# Altium schematic sheet Controller.SchDoc
size 254 x 228 mm; SheetNumber: 12; SheetTotal: 12
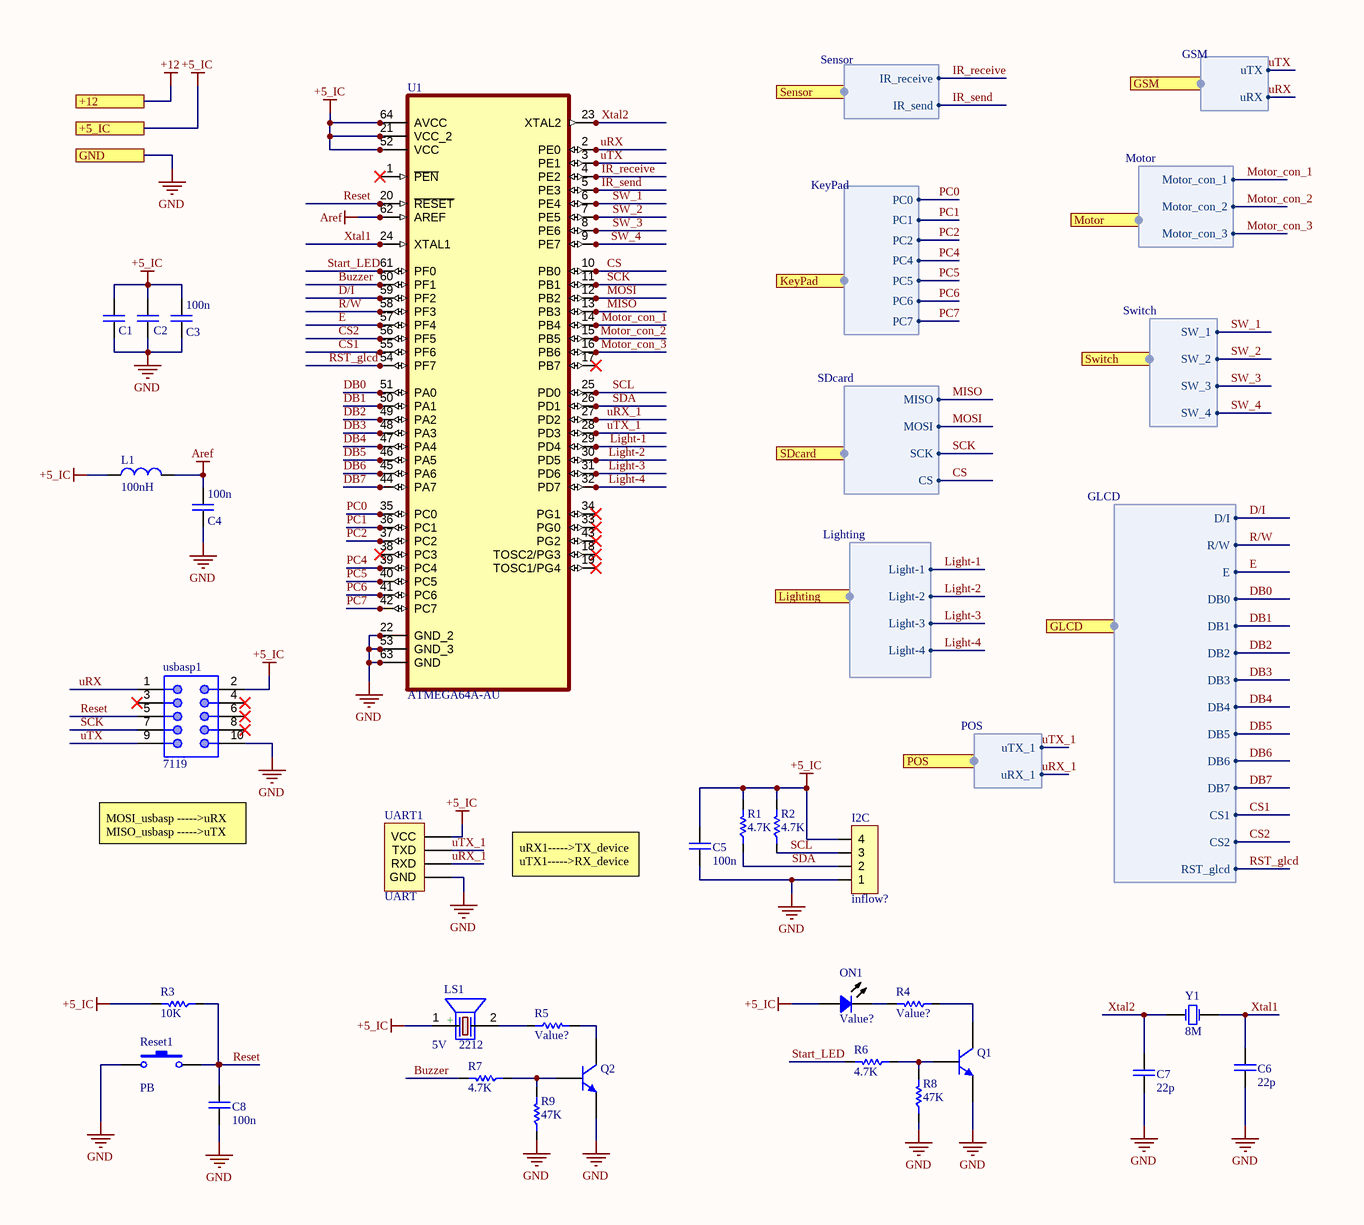
[diagram p0: Controller.SchDoc]

## Parts
C1  (no value)  [CAP 1206/3216]
C2  (no value)  [CAP 1206/3216]
C3  100n  [CAP 1206/3216]
C4  100n  [CAP 1206/3216]
C5  100n  [CAP 1206/3216]
C6  22p  [CAP 1206/3216]
C7  22p  [CAP 1206/3216]
C8  100n  [CAP 1206/3216]
I2C  Inflow: inflow?  [MOLEX KK 0022272041]  (hidden comment: 4'Pin)
L1  100nH  [IND1206]
LS1  Inflow: 2212  [BZ_SJ]  (hidden comment: 5V)
ON1  Value?  [LED 1206/3216 GREEN]
Q1  NPN  [SOT23_N]  (value not drawn)
Q2  NPN  [SOT23_N]  (value not drawn)
R1  value 4.7K  [RES 1206 (3216X08L)]  (hidden comment: Value?)
R2  value 4.7K  [RES 1206 (3216X08L)]  (hidden comment: Value?)
R3  value 10K  [RES 1206 (3216X08L)]  (hidden comment: 4.7K)
R4  value Value?  [RES 1206 (3216X08L)]  (hidden comment: 47K)
R5  Value?  [RES 1206 (3216X08L)]
R6  value 4.7K  [RES 1206 (3216X08L)]  (hidden comment: Value?)
R7  4.7K  [RES 1206 (3216X08L)]
R8  value 47K  [RES 1206 (3216X08L)]  (hidden comment: 4.7K)
R9  47K  [RES 1206 (3216X08L)]
Reset1  PB  [SW_PB_SMD_2PIN_SPST_6X3X2]
U1  ATMEGA64A-AU  [QFP80P1600X1600X120-64N]
UART1  UART  [MOLEX KK 0022272041]
usbasp1  Inflow: 7119  [BOX-HDR-5X2-2.54mm-S]  (hidden comment: 5x2)
Y1  8M  [XTAL Small]

## Ports
+5_IC, +12, GLCD (harness GLCD), GND, GSM (harness GSM), KeyPad (harness KeyPad), Lighting (harness Lighting), Motor (harness Motor), POS (harness POS), SDcard (harness SDcard), Sensor (harness Sensor), Switch (harness Switch)

## Harnesses
GSM: uTX, uRX
Switch: SW_1, SW_2, SW_3, SW_4
GLCD: D/I, R/W, E, DB0, DB1, DB2, DB3, DB4, DB5, DB6, DB7, CS1, CS2, RST_glcd
Sensor: IR_receive, IR_send
KeyPad: PC0, PC1, PC2, PC4, PC5, PC6, PC7
SDcard: MISO, MOSI, SCK, CS
Lighting: Light-1, Light-2, Light-3, Light-4
Motor: Motor_con_1, Motor_con_2, Motor_con_3
POS: uTX_1, uRX_1

## Nets
+5_IC: C1.1 C2.1 C3.1 C5.1 I2C.4 L1.1 LS1.1(+) ON1.1 R1.2 R2.2 R3.2 U1.21(VCC_2) U1.52(VCC) U1.64(AVCC) UART1.1(VCC) usbasp1.2 ; port +5_IC
+12: port +12
Aref: C4.1 L1.2 U1.62(AREF)
GND: C1.2 C2.2 C3.2 C4.2 C5.2 C6.2 C7.2 C8.2 I2C.1 Q1.2(E) Q2.2(E) R8.1 R9.1 Reset1.1 U1.22(GND_2) U1.53(GND_3) U1.63(GND) UART1.4(GND) usbasp1.10 ; port GND
Buzzer: R7.2 U1.60(PF1)
CS: U1.10(PB0) ; port SDcard.CS
CS1: U1.55(PF6) ; port GLCD.CS1
CS2: U1.56(PF5) ; port GLCD.CS2
D/I: U1.59(PF2) ; port GLCD.D/I
DB0: U1.51(PA0) ; port GLCD.DB0
DB1: U1.50(PA1) ; port GLCD.DB1
DB2: U1.49(PA2) ; port GLCD.DB2
DB3: U1.48(PA3) ; port GLCD.DB3
DB4: U1.47(PA4) ; port GLCD.DB4
DB5: U1.46(PA5) ; port GLCD.DB5
DB6: U1.45(PA6) ; port GLCD.DB6
DB7: U1.44(PA7) ; port GLCD.DB7
E: U1.57(PF4) ; port GLCD.E
IR_receive: U1.4(PE2) ; port Sensor.IR_receive
IR_send: U1.5(PE3) ; port Sensor.IR_send
Light-1: U1.29(PD4) ; port Lighting.Light-1
Light-2: U1.30(PD5) ; port Lighting.Light-2
Light-3: U1.31(PD6) ; port Lighting.Light-3
Light-4: U1.32(PD7) ; port Lighting.Light-4
MISO: U1.13(PB3) ; port SDcard.MISO
MOSI: U1.12(PB2) ; port SDcard.MOSI
Motor_con_1: U1.14(PB4) ; port Motor.Motor_con_1
Motor_con_2: U1.15(PB5) ; port Motor.Motor_con_2
Motor_con_3: U1.16(PB6) ; port Motor.Motor_con_3
PC0: U1.35(PC0) ; port KeyPad.PC0
PC1: U1.36(PC1) ; port KeyPad.PC1
PC2: U1.37(PC2) ; port KeyPad.PC2
PC4: U1.39(PC4) ; port KeyPad.PC4
PC5: U1.40(PC5) ; port KeyPad.PC5
PC6: U1.41(PC6) ; port KeyPad.PC6
PC7: U1.42(PC7) ; port KeyPad.PC7
R/W: U1.58(PF3) ; port GLCD.R/W
Reset: C8.1 R3.1 Reset1.2 U1.20(~{RESET}) usbasp1.5
RST_glcd: U1.54(PF7) ; port GLCD.RST_glcd
SCK: U1.11(PB1) usbasp1.7 ; port SDcard.SCK
SCL: I2C.3 R2.1 U1.25(PD0)
SDA: I2C.2 R1.1 U1.26(PD1)
Start_LED: R6.2 U1.61(PF0)
SW_1: U1.6(PE4) ; port Switch.SW_1
SW_2: U1.7(PE5) ; port Switch.SW_2
SW_3: U1.8(PE6) ; port Switch.SW_3
SW_4: U1.9(PE7) ; port Switch.SW_4
uRX: U1.2(PE0) usbasp1.1 ; port GSM.uRX
uRX_1: U1.27(PD2) UART1.3(RXD) ; port POS.uRX_1
uTX: U1.3(PE1) usbasp1.9 ; port GSM.uTX
uTX_1: U1.28(PD3) UART1.2(TXD) ; port POS.uTX_1
Xtal1: C6.1 U1.24(XTAL1) Y1.2(OSC2)
Xtal2: C7.1 U1.23(XTAL2) Y1.1(OSC1)
NetLS1_2: LS1.2(-) R5.1
NetON1_2: ON1.2 R4.2
NetQ1_1: Q1.1(B) R6.1 R8.2
NetQ1_3: Q1.3(C) R4.1
NetQ2_1: Q2.1(B) R7.1 R9.2
NetQ2_3: Q2.3(C) R5.2

Not connected (* = marked no-connect by the designer): U1 1(~{PEN})* 17(PB7)* 18(TOSC2/PG3)* 19(TOSC1/PG4)* 33(PG0)* 34(PG1)* 38(PC3)* 43(PG2)*; usbasp1 3* 4* 6* 8*

## Notes on the sheet
- MOSI_usbasp ----->uRX MISO_usbasp ----->uTX
- uRX1----->TX_device
  uTX1----->RX_device
- DWG. NO.
- REV.
- SHT.
- THIS DOCUMENT AND THE DATA DISCLOSED HEREIN OR HEREWITH IS THE PROPERTY OF ALTIUM LIMITED AND MAY BE FREELY DISTRIBUTED IN WHOLE. NO RIGHTS ARE RESERVED OR EXPRESS OR IMPLIED WARANTEE GIVEN.
- REVISION
- DESCRIPTION
- DATE
- APPROVED
- ENG:
- APPROVALS
- PROJECT
- DSN:
- CHK:
- REFERENCE DOCUMENTS
- PROJECT REVISION:
- TITLE
- DOCUMENT REVISION:
- DESIGN ITEM:
- BOM:
- FAB DWG:
- PCB DWG:
- ASSY DWG:
- SCALE:
- SIZE
- B
- CAGE CODE
- FILE NAME
- DWG NO.
- SHEET
- OF
- REV

## Library data of the parts
C1-C8 = Cap_Multi_SMD_100nF_1206: Bipolar ceramic capacitor SMD; Type: MultiLayer; Inflow: inflow?; Rating: 50V; Validation: Valid; Package: 1206
  C3-C5 C8: Value: 100n
  C6 C7: Value: 22p
I2C = Con_Signal_4: Signal Connector 4'Pin; Rating: Rating?; Validation: Valid; Value: 4'Pin; Package: Package?; Type: Type?
L1 = Ind_SMD_1206: Inductor; Inflow: inflow?; Type: SMD; Rating: Rating?; Validation: Valid; Package: 1206; Value: 100nH
LS1 = Other_Elec_Buzzer: Magnetic Transducer Buzzer; Rating: 12mm; Validation: Valid; Type: Buzzer; Package: Dip; Value: 5V
ON1 = Semi_LED_SMD: LED; Inflow: inflow?; Rating: Rating?; Validation: Valid; Package: Package?; Type: LED; Value: Value?
Q1 Q2 = Semi_BJT_BC817: NPN General purpose Transistor; Rating: Rating?; Type: Type?; Validation: Valid; Inflow: inflow?; Value: NPN; Package: Package?
R1 R2 = Res_SMD_0805: Resistor; Inflow: inflow?; Rating: 0.125W; Validation: Valid; Package: 0805; Type: 10%
R3-R9 = Res_SMD_1206: Resistor; Inflow: inflow?; Rating: 0.25W; Validation: Valid; Package: 1206; Type: 10%
  R5: Value: Value?
  R7: Value: 4.7K
  R9: Value: 47K
Reset1 = SW_PushButton_2_SMD: SMT Tactile ‎Switch; Rating: 2b; Validation: Valid; Inflow: 8260; Type: Vertical; Package: SMD; Value: PB
U1 = ATMEGA64A-AU: AVR AVRÂ® ATmega Microcontroller IC 8-Bit 16MHz 64KB (32K x 16) FLASH 64-TQFP (14x14); MF: Microchip; SnapEDA_Link: https://www.snapeda.com/parts/ATMEGA64A-AU/Microchip/view-part/?ref=snap; Package: TQFP-64 Microchip; Value: *; MP: ATMEGA64A-AU; Check_prices: https://www.snapeda.com/parts/ATMEGA64A-AU/Microchip/view-part/?ref=eda
UART1 = Con_UART: UART Connector; Rating: Rating?; Validation: Valid; Inflow: 4528; Package: Package?; Type: Type?; Value: UART
usbasp1 = Con_IDC_5x2: Male Box Header, 10 pins; Rating: Rating?; Validation: NT; Value: 5x2; Package: Package?; Type: Type?
Y1 = Other_Elec_Xtal_THT: Crystal Oscillator; Rating: Rating?; Inflow: inflow?; Validation: Valid; Type: Quartz; Package: Dip; Value: 8M